# Altium schematic sheet Audio.SchDoc: Audio
size A4; DocumentNumber: MB1165; Revision: C.1; SheetNumber: 5; SheetTotal: 17; Project: STM32469I-EVAL
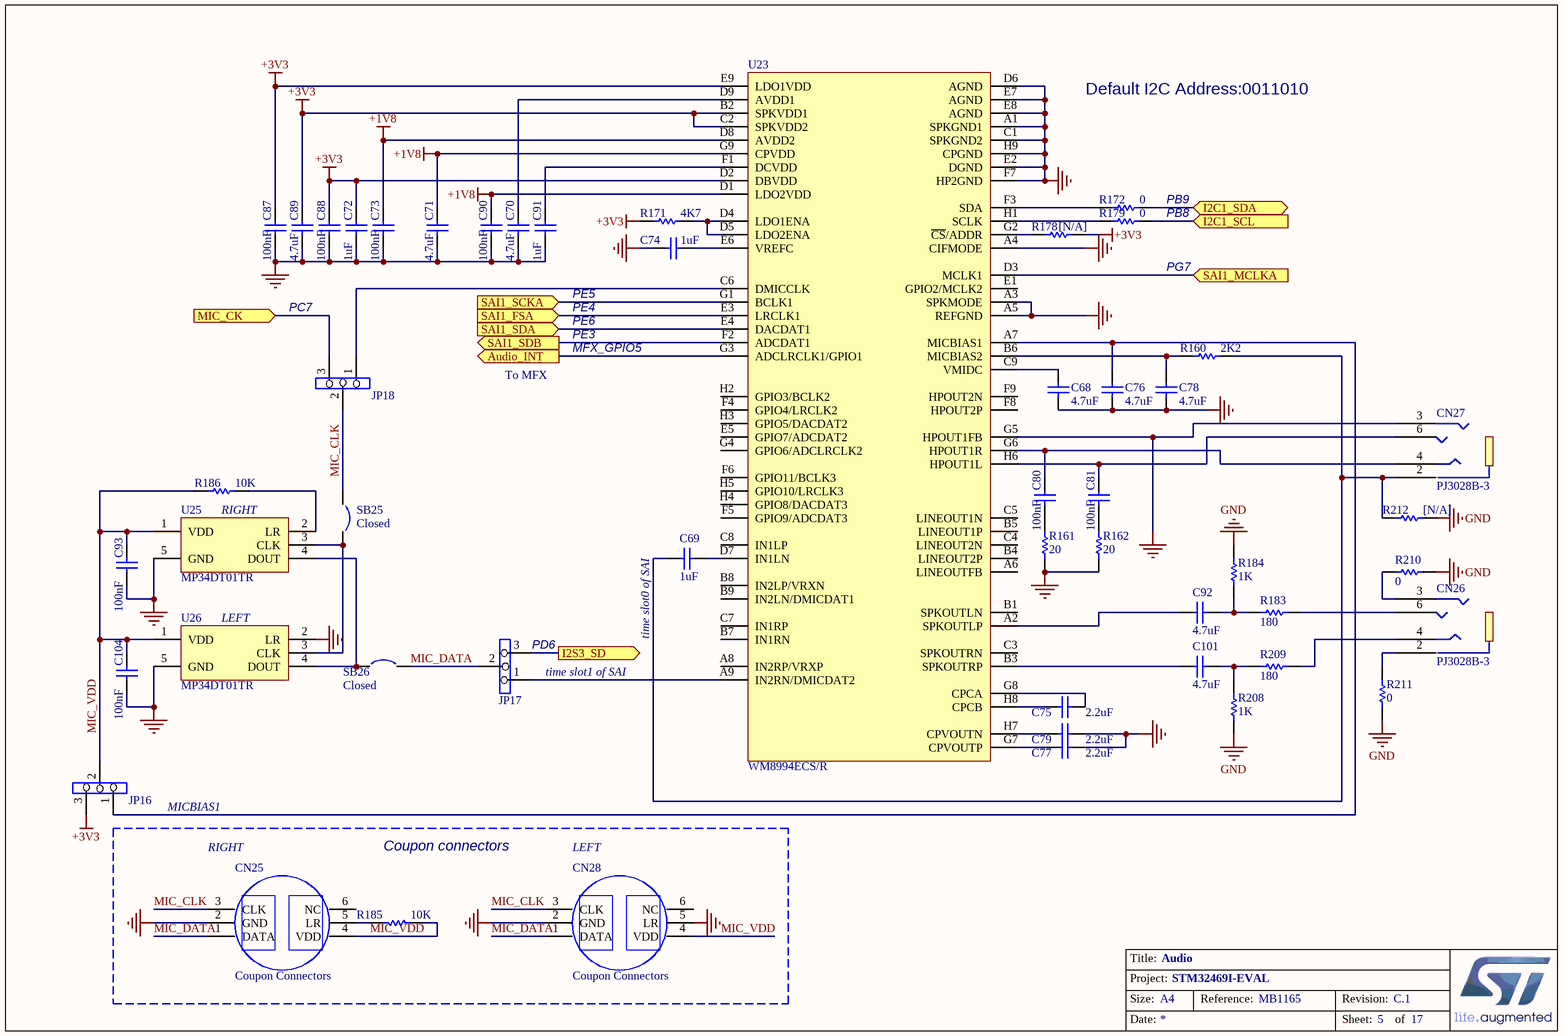
[diagram p0: Audio.SchDoc]

## Parts
C68  4.7uF  [0603C]
C69  1uF  [0603C]
C70  4.7uF  [0603C]
C71  4.7uF  [0603C]
C72  1uF  [0603C]
C73  100nF  [0603C]
C74  1uF  [0603C]
C75  2.2uF  [0603C]
C76  4.7uF  [0603C]
C77  2.2uF  [0603C]
C78  4.7uF  [0603C]
C79  2.2uF  [0603C]
C80  100nF  [0603C]
C81  100nF  [0603C]
C87  100nF  [0603C]
C88  100nF  [0603C]
C89  4.7uF  [0603C]
C90  100nF  [0603C]
C91  1uF  [0603C]
C92  4.7uF  [0603C]
C93  100nF  [0603C]
C101  4.7uF  [0603C]
C104  100nF  [0603C]
CN25  Coupon Connectors  [Coupon]
CN26  PJ3028B-3  [PJ3028B]
CN27  PJ3028B-3  [PJ3028B]
CN28  Coupon Connectors  [Coupon]
JP16  (no value)  [SIP3]
JP17  (no value)  [SIP3]
JP18  (no value)  [SIP3]
R160  2K2  [0603R]
R161  20  [0603R]
R162  20  [0603R]
R171  4K7  [0603R]
R172  0  [0603R]
R178  [N/A]  [0603R]
R179  0  [0603R]
R183  180  [0402R]
R184  1K  [0402R]
R185  10K  [0603R]
R186  10K  [0603R]
R208  1K  [0402R]
R209  180  [0402R]
R210  0  [0603R]
R211  0  [0603R]
R212  [N/A]  [0603R]
SB25  Closed  [SB_0603]
SB26  Closed  [SB_0603]
U23  WM8994ECS/R  [BGA72_0R5_4R5X4]
U25  MP34DT01TR  [MP34DT01TR]
U26  MP34DT01TR  [MP34DT01TR]

## Blocks framed on the sheet
Coupon connectors: CN25 CN28 R185

## Ports
Audio_INT (out), I2C1_SCL (in), I2C1_SDA (bidir), I2S3_SD (out), MIC_CK (in), SAI1_FSA (in), SAI1_MCLKA (in), SAI1_SCKA (in), SAI1_SDA (in), SAI1_SDB (out)

## Nets
+1V8: C71.1 C73.1 C90.1 U23.D1(LDO2VDD) U23.D8(AVDD2) U23.G9(CPVDD)
+3V3: C72.1 C87.1 C88.1 C89.1 JP16.3 R171.2 R178.1 U23.B2(SPKVDD1) U23.C2(SPKVDD2) U23.D2(DBVDD) U23.E9(LDO1VDD)
GND: C68.1 C70.2 C71.2 C72.2 C73.2 C74.2 C76.1 C77.2 C78.1 C79.2 C87.2 C88.2 C89.2 C90.2 C91.2 C93.2 C104.2 CN25.2(GND) CN27.3 CN28.2(GND) CN28.5(LR) R161.2 R162.2 R184.2 R208.1 R210.2 R211.2 R212.1 U23.A1(SPKGND1) U23.A3(SPKMODE) U23.A4(CIFMODE) U23.A5(REFGND) U23.C1(SPKGND2) U23.D6(AGND) U23.E2(DGND) U23.E7(AGND) U23.E8(AGND) U23.F7(HP2GND) U23.G5(HPOUT1FB) U23.H9(CPGND) U25.5(GND) U26.2(LR) U26.5(GND)
Audio_INT: U23.G3(ADCLRCLK1/GPIO1) ; port Audio_INT
I2C1_SCL: R179.1 ; port I2C1_SCL
I2C1_SDA: R172.1 ; port I2C1_SDA
I2S3_SD: JP17.3 ; port I2S3_SD
MIC_CK: JP18.3 ; port MIC_CK
MIC_CLK: CN25.3(CLK) CN28.3(CLK) JP18.2 SB25.1
MIC_DATA: CN25.1(DATA) CN28.1(DATA) JP17.2 SB26.2
MIC_VDD: C93.1 C104.1 CN25.4(VDD) CN28.4(VDD) JP16.2 R185.2 R186.2 U25.1(VDD) U26.1(VDD)
SAI1_FSA: U23.E3(LRCLK1) ; port SAI1_FSA
SAI1_MCLKA: U23.D3(MCLK1) ; port SAI1_MCLKA
SAI1_SCKA: U23.G1(BCLK1) ; port SAI1_SCKA
SAI1_SDA: U23.E4(DACDAT1) ; port SAI1_SDA
SAI1_SDB: U23.F2(ADCDAT1) ; port SAI1_SDB
NetC68_2: C68.2 U23.C9(VMIDC)
NetC69_1: C69.1 U23.D7(IN1LN)
NetC69_2: C69.2 CN27.2 R160.1 R212.2
NetC70_1: C70.1 U23.D9(AVDD1)
NetC74_1: C74.1 U23.E6(VREFC)
NetC75_1: C75.1 U23.H8(CPCB)
NetC75_2: C75.2 U23.G8(CPCA)
NetC76_2: C76.2 JP16.1 U23.A7(MICBIAS1)
NetC77_1: C77.1 U23.G7(CPVOUTP)
NetC78_2: C78.2 R160.2 U23.B6(MICBIAS2)
NetC79_1: C79.1 U23.H7(CPVOUTN)
NetC80_1: C80.1 CN27.4 U23.G6(HPOUT1R)
NetC80_2: C80.2 R161.1
NetC81_1: C81.1 CN27.6 U23.H6(HPOUT1L)
NetC81_2: C81.2 R162.1
NetC91_1: C91.1 U23.F1(DCVDD)
NetC92_1: C92.1 R183.1 R184.1
NetC92_2: C92.2 U23.A2(SPKOUTLP)
NetC101_1: C101.1 R208.2 R209.2
NetC101_2: C101.2 U23.B3(SPKOUTRP)
NetCN25_5: CN25.5(LR) R185.1
NetCN26_2: CN26.2 R211.1
NetCN26_3: CN26.3 R210.1
NetCN26_4: CN26.4 R209.1
NetCN26_6: CN26.6 R183.2
NetJP17_1: JP17.1 U23.A9(IN2RN/DMICDAT2)
NetJP18_1: JP18.1 U23.C6(DMICCLK)
NetR171_1: R171.1 U23.D4(LDO1ENA) U23.D5(LDO2ENA)
NetR172_2: R172.2 U23.F3(SDA)
NetR178_2: R178.2 U23.G2(~{CS}/ADDR)
NetR179_2: R179.2 U23.H1(SCLK)
NetR186_1: R186.1 U25.2(LR)
NetSB25_2: SB25.2 U25.3(CLK) U26.3(CLK)
NetSB26_1: SB26.1 U25.4(DOUT) U26.4(DOUT)

Not connected (* = marked no-connect by the designer): CN25 6(NC); CN28 6(NC); U23 A6(LINEOUTFB) A8(IN2RP/VRXP) B1(SPKOUTLN) B4(LINEOUT2P) B5(LINEOUT1P) B7(IN1RN) B8(IN2LP/VRXN) B9(IN2LN/DMICDAT1) C3(SPKOUTRN) C4(LINEOUT2N) C5(LINEOUT1N) C7(IN1RP) C8(IN1LP) E1(GPIO2/MCLK2) E5(GPIO7/ADCDAT2) F4(GPIO4/LRCLK2) F5(GPIO9/ADCDAT3) F6(GPIO11/BCLK3) F8(HPOUT2P) F9(HPOUT2N) G4(GPIO6/ADCLRCLK2) H2(GPIO3/BCLK2) H3(GPIO5/DACDAT2) H4(GPIO8/DACDAT3) H5(GPIO10/LRCLK3)

## Notes on the sheet
- Default I2C Address:0011010
- PB9
- PB8
- PC7
- PE5
- PE4
- PG7
- To MFX
- PE6
- PE3
- MFX_GPIO5
- RIGHT
- (near U26) LEFT
- (near JP17) PD6
- (near C69) time slot0 of SAI
- (near JP17) time slot1 of SAI
- MICBIAS1
- LEFT
- Title:
- Project:
- Size:
- Date:
- A4
- Reference:
- Sheet:
- Revision:
- of

## Library data of the parts
C68 C70 C71 C73 C76 C78 C80 C81 C87-C90 C93 C104 = Cap: Capacitor; Value: 10nF; Published: 8-Jun-2000; Revision: July-2002: Re-released for DXP Platform.; Publisher: Altium Limited
C69 C72 C74 C75 C77 C79 C91 = CAP: Capacitor; Value: 100nF; Published: 8-Jun-2000; Revision: July-2002: Re-released for DXP Platform.; Publisher: Altium Limited
C92 C101 = Cap: Capacitor; Value: 10nF; Ordered by: Subcon; Published: 8-Jun-2000; Revision: July-2002: Re-released for DXP Platform.; Publisher: Altium Limited
CN25 CN28 = Coupon Connectors: Header, 3-Pin, Single row; Revision: 17-Jul-2002: Re-released for DXP Platform.; Publisher: Altium Limited
JP16-JP18 = Jumper3
R160-R162 R171 R172 R178 R179 R185 R186 R212 = Res1: Resistor; Value: 1K; Published: 8-Jun-2000; Revision: July-2002: Re-released for DXP Platform.; Publisher: Altium Limited
R183 R209-R211 = Res1: Resistor; Value: 1K; Ordered by: Subcon; Published: 8-Jun-2000; Revision: July-2002: Re-released for DXP Platform.; Publisher: Altium Limited
R184 R208 = Res1: Resistor; Ordered by: Subcon; Published: 8-Jun-2000; Revision: July-2002: Re-released for DXP Platform.; Publisher: Altium Limited; Value: 1K
SB25 SB26 = Circuit Breaker_close: Circuit Breaker; Published: 24-Mar-1999; Revision: July-2002: Re-released for DXP Platform.; Publisher: Altium Limited
U25 U26 = MP34DT01TR: MEMS audio sensor; Revision: 17-Jul-2002: Re-released for DXP Platform.; Publisher: Altium Limited